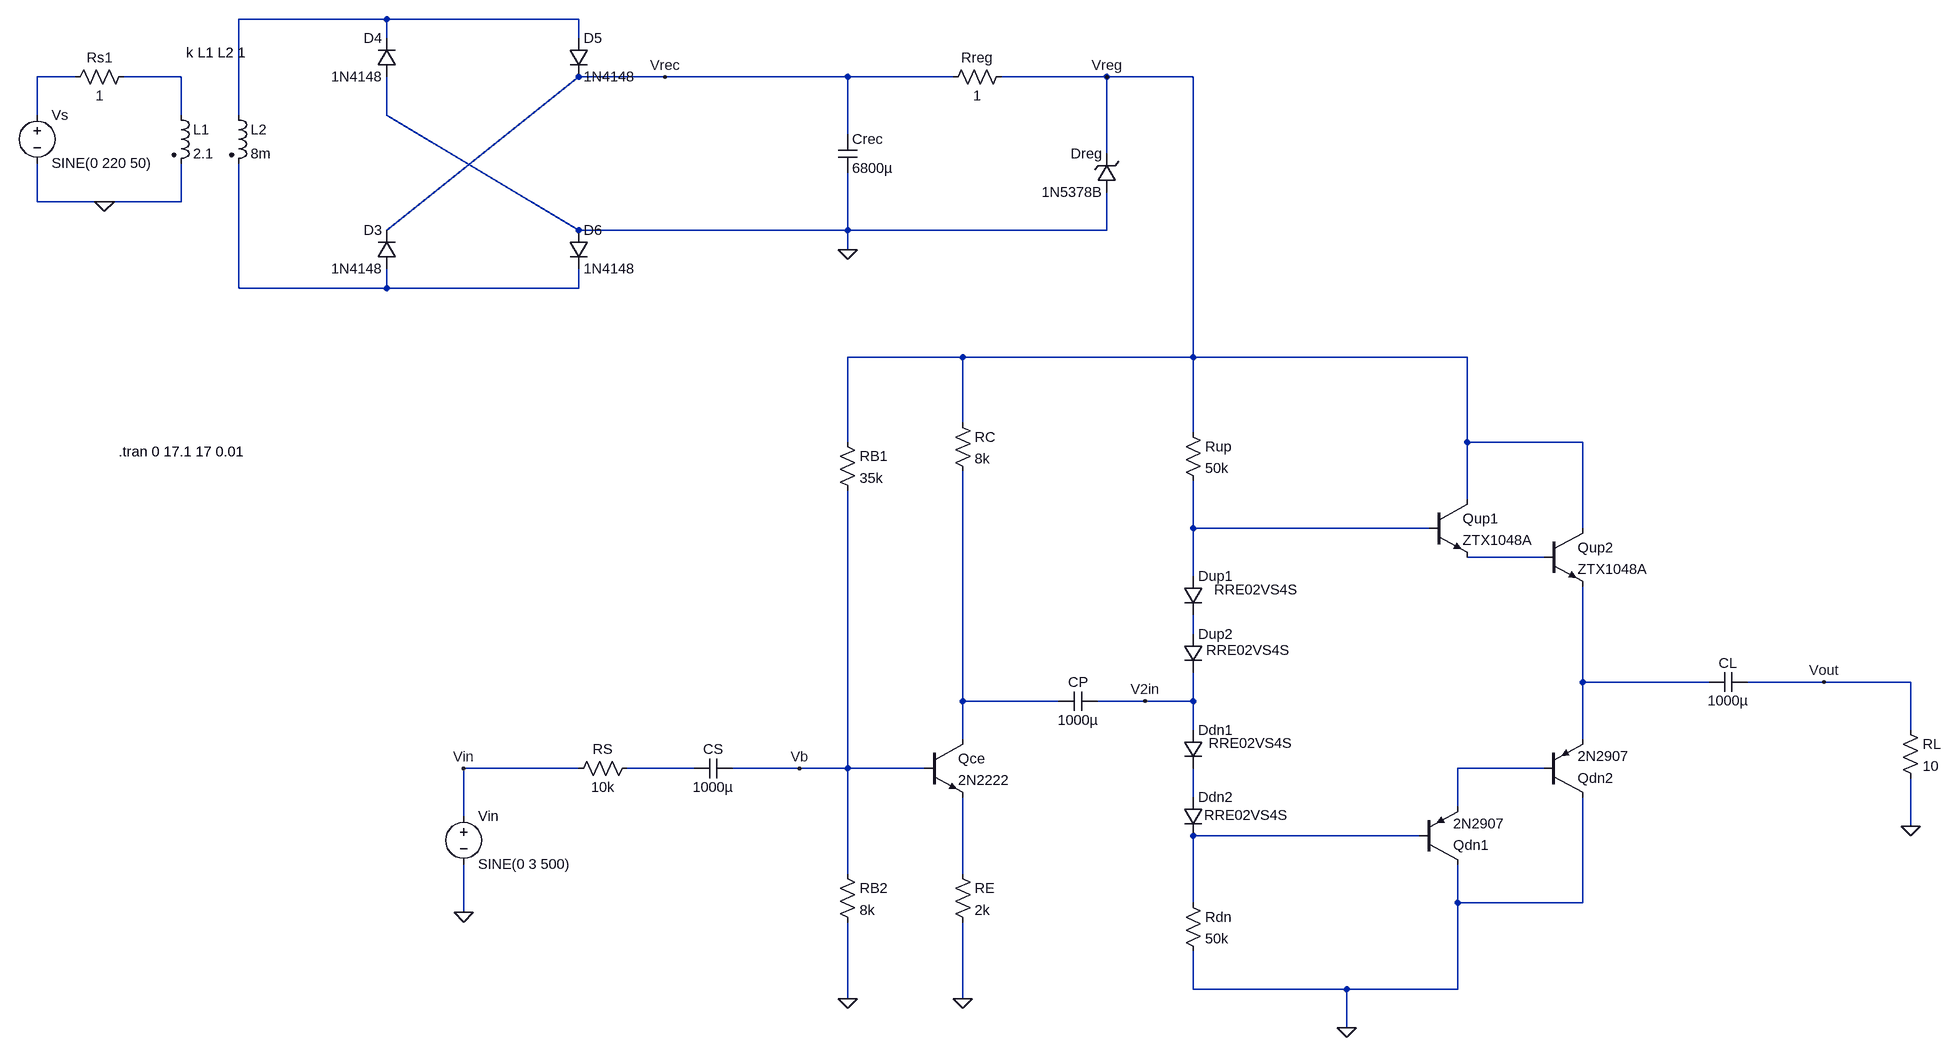
[diagram p0: schematic Final Project.asc]
Final Project.asc, the LTspice schematic file:
Version 4
SHEET 1 1460 836
WIRE -1408 -928 -1808 -928
WIRE -1088 -928 -1408 -928
WIRE -1408 -896 -1408 -928
WIRE -1088 -896 -1088 -928
WIRE -2080 -832 -2144 -832
WIRE -1904 -832 -2000 -832
WIRE -944 -832 -1088 -832
WIRE -640 -832 -944 -832
WIRE -464 -832 -640 -832
WIRE -208 -832 -384 -832
WIRE -64 -832 -208 -832
WIRE -2144 -768 -2144 -832
WIRE -1904 -768 -1904 -832
WIRE -1808 -768 -1808 -928
WIRE -1408 -768 -1408 -832
WIRE -640 -736 -640 -832
WIRE -208 -704 -208 -832
WIRE -2144 -624 -2144 -688
WIRE -2032 -624 -2144 -624
WIRE -1904 -624 -1904 -688
WIRE -1904 -624 -2032 -624
WIRE -1408 -576 -1088 -832
WIRE -1088 -576 -1408 -768
WIRE -640 -576 -640 -672
WIRE -640 -576 -1088 -576
WIRE -208 -576 -208 -640
WIRE -208 -576 -640 -576
WIRE -640 -544 -640 -576
WIRE -1808 -480 -1808 -688
WIRE -1408 -480 -1408 -512
WIRE -1408 -480 -1808 -480
WIRE -1088 -480 -1088 -512
WIRE -1088 -480 -1408 -480
WIRE -448 -336 -640 -336
WIRE -64 -336 -64 -832
WIRE -64 -336 -448 -336
WIRE 448 -336 -64 -336
WIRE -448 -192 -448 -336
WIRE -64 -176 -64 -336
WIRE -640 -160 -640 -336
WIRE 448 -160 448 -336
WIRE 640 -160 448 -160
WIRE 448 -64 448 -160
WIRE -64 -16 -64 -96
WIRE 384 -16 -64 -16
WIRE 640 -16 640 -160
WIRE 576 32 448 32
WIRE -64 64 -64 -16
WIRE -64 160 -64 128
WIRE 640 240 640 80
WIRE 944 240 640 240
WIRE 1136 240 1008 240
WIRE 1280 240 1136 240
WIRE -448 272 -448 -112
WIRE -288 272 -448 272
WIRE -144 272 -224 272
WIRE -64 272 -64 224
WIRE -64 272 -144 272
WIRE -64 320 -64 272
WIRE 1280 320 1280 240
WIRE -448 336 -448 272
WIRE 640 336 640 240
WIRE -1088 384 -1280 384
WIRE -896 384 -1008 384
WIRE -720 384 -832 384
WIRE -640 384 -640 -80
WIRE -640 384 -720 384
WIRE -512 384 -640 384
WIRE 576 384 432 384
WIRE -64 432 -64 384
WIRE 432 448 432 384
WIRE -1280 464 -1280 384
WIRE 1280 480 1280 400
WIRE 368 496 -64 496
WIRE -640 560 -640 384
WIRE -448 560 -448 432
WIRE -64 608 -64 496
WIRE 432 608 432 544
WIRE 640 608 640 432
WIRE 640 608 432 608
WIRE -1280 624 -1280 544
WIRE -64 752 -64 688
WIRE 192 752 -64 752
WIRE 432 752 432 608
WIRE 432 752 192 752
WIRE -640 768 -640 640
WIRE -448 768 -448 640
WIRE 192 816 192 752
FLAG 1280 480 0
FLAG -1280 624 0
FLAG 192 816 0
FLAG -448 768 0
FLAG -640 768 0
FLAG -144 272 V2in
FLAG -720 384 Vb
FLAG 1136 240 Vout
FLAG -944 -832 Vrec
FLAG -640 -544 0
FLAG -2032 -624 0
FLAG -1280 384 Vin
FLAG -208 -832 Vreg
SYMBOL res -80 -192 R0
SYMATTR InstName Rup
SYMATTR Value 50k
SYMBOL diode -80 64 R0
WINDOW 3 51 22 Left 2
SYMATTR Value RRE02VS4S
SYMATTR InstName Dup1
SYMBOL diode -80 320 R0
WINDOW 3 42 22 Left 2
SYMATTR Value RRE02VS4S
SYMATTR InstName Ddn1
SYMBOL res -80 592 R0
SYMATTR InstName Rdn
SYMATTR Value 50k
SYMBOL npn 384 -64 R0
SYMATTR InstName Qup1
SYMATTR Value ZTX1048A
SYMBOL pnp 368 544 M180
SYMATTR InstName Qdn1
SYMATTR Value 2N2907
SYMBOL pnp 576 432 M180
SYMATTR InstName Qdn2
SYMATTR Value 2N2907
SYMBOL res 1264 304 R0
SYMATTR InstName RL
SYMATTR Value 10
SYMBOL cap 1008 224 R90
WINDOW 0 0 32 VBottom 2
WINDOW 3 32 32 VTop 2
SYMATTR InstName CL
SYMATTR Value 1000µ
SYMBOL diode -80 160 R0
WINDOW 3 38 27 Left 2
SYMATTR Value RRE02VS4S
SYMATTR InstName Dup2
SYMBOL diode -80 432 R0
WINDOW 3 34 30 Left 2
SYMATTR Value RRE02VS4S
SYMATTR InstName Ddn2
SYMBOL voltage -1280 448 R0
WINDOW 123 0 0 Left 0
WINDOW 39 0 0 Left 0
SYMATTR InstName Vin
SYMATTR Value SINE(0 3 500)
SYMBOL res -992 368 R90
WINDOW 0 0 56 VBottom 2
WINDOW 3 32 56 VTop 2
SYMATTR InstName RS
SYMATTR Value 10k
SYMBOL cap -832 368 R90
WINDOW 0 0 32 VBottom 2
WINDOW 3 32 32 VTop 2
SYMATTR InstName CS
SYMATTR Value 1000µ
SYMBOL npn 576 -16 R0
SYMATTR InstName Qup2
SYMATTR Value ZTX1048A
SYMBOL npn -512 336 R0
SYMATTR InstName Qce
SYMATTR Value 2N2222
SYMBOL res -464 -208 R0
SYMATTR InstName RC
SYMATTR Value 8k
SYMBOL res -464 544 R0
SYMATTR InstName RE
SYMATTR Value 2k
SYMBOL res -656 -176 R0
SYMATTR InstName RB1
SYMATTR Value 35k
SYMBOL res -656 544 R0
SYMATTR InstName RB2
SYMATTR Value 8k
SYMBOL cap -224 256 R90
WINDOW 0 0 32 VBottom 2
WINDOW 3 32 32 VTop 2
SYMATTR InstName CP
SYMATTR Value 1000µ
SYMBOL voltage -2144 -784 R0
WINDOW 123 0 0 Left 0
WINDOW 39 0 0 Left 0
SYMATTR InstName Vs
SYMATTR Value SINE(0 220 50)
SYMBOL res -1984 -848 R90
WINDOW 0 0 56 VBottom 2
WINDOW 3 32 56 VTop 2
SYMATTR InstName Rs1
SYMATTR Value 1
SYMBOL ind2 -1920 -784 R0
SYMATTR InstName L1
SYMATTR Value 2.1
SYMATTR Type ind
SYMBOL ind2 -1824 -784 R0
SYMATTR InstName L2
SYMATTR Value 8m
SYMATTR Type ind
SYMBOL diode -1392 -512 R180
WINDOW 0 24 64 Left 2
WINDOW 3 24 0 Left 2
SYMATTR InstName D3
SYMATTR Value 1N4148
SYMBOL diode -1392 -832 R180
WINDOW 0 24 64 Left 2
WINDOW 3 24 0 Left 2
SYMATTR InstName D4
SYMATTR Value 1N4148
SYMBOL diode -1104 -896 R0
SYMATTR InstName D5
SYMATTR Value 1N4148
SYMBOL diode -1104 -576 R0
SYMATTR InstName D6
SYMATTR Value 1N4148
SYMBOL cap -656 -736 R0
SYMATTR InstName Crec
SYMATTR Value 6800µ
SYMBOL zener -192 -640 R180
WINDOW 0 24 64 Left 2
WINDOW 3 24 0 Left 2
SYMATTR InstName Dreg
SYMATTR Value 1N5378B
SYMATTR Description Diode
SYMATTR Type diode
SYMBOL res -368 -848 R90
WINDOW 0 0 56 VBottom 2
WINDOW 3 32 56 VTop 2
SYMATTR InstName Rreg
SYMATTR Value 1
TEXT -2008 -144 Left 2 !.tran 0 17.1 17 0.01
TEXT -1896 -872 Left 2 !k L1 L2 1

The netlist it stands for:
* Final Project.asc
Rup Vreg N005 50k
Dup1 N005 N007 RRE02VS4S
Ddn1 V2in N012 RRE02VS4S
Rdn N013 0 50k
Qup1 Vreg N005 N006 0 ZTX1048A
Qdn1 0 N013 N011 0 2N2907
Qdn2 0 N011 N008 0 2N2907
RL Vout 0 10
CL Vout N008 1000µ
Dup2 N007 V2in RRE02VS4S
Ddn2 N012 N013 RRE02VS4S
Vin Vin 0 SINE(0 3 500)
RS N010 Vin 10k
CS Vb N010 1000µ
Qup2 Vreg N006 N008 0 ZTX1048A
Qce N009 Vb N014 0 2N2222
RC Vreg N009 8k
RE N014 0 2k
RB1 Vreg Vb 35k
RB2 Vb 0 8k
CP V2in N009 1000µ
Vs N002 0 SINE(0 220 50)
Rs1 N003 N002 1
L1 N003 0 2.1
L2 N001 N004 8m
D3 N004 Vrec 1N4148
D4 0 N001 1N4148
D5 N001 Vrec 1N4148
D6 0 N004 1N4148
Crec Vrec 0 6800µ
Dreg 0 Vreg 1N5378B
Rreg Vreg Vrec 1
.model D D
.lib standard.dio
.model NPN NPN
.model PNP PNP
.lib standard.bjt
.tran 0 17.1 17 0.01
k L1 L2 1
.backanno
.end